# EasyEDA schematic SCH_Full Bridge Rectifier V1_2023-05-05.json
TITLE: Sheet_1; REV: 1.0; Date: 2023-03-08; Sheet: 1/1; Drawn By: richwasnothere; Company: Your Company
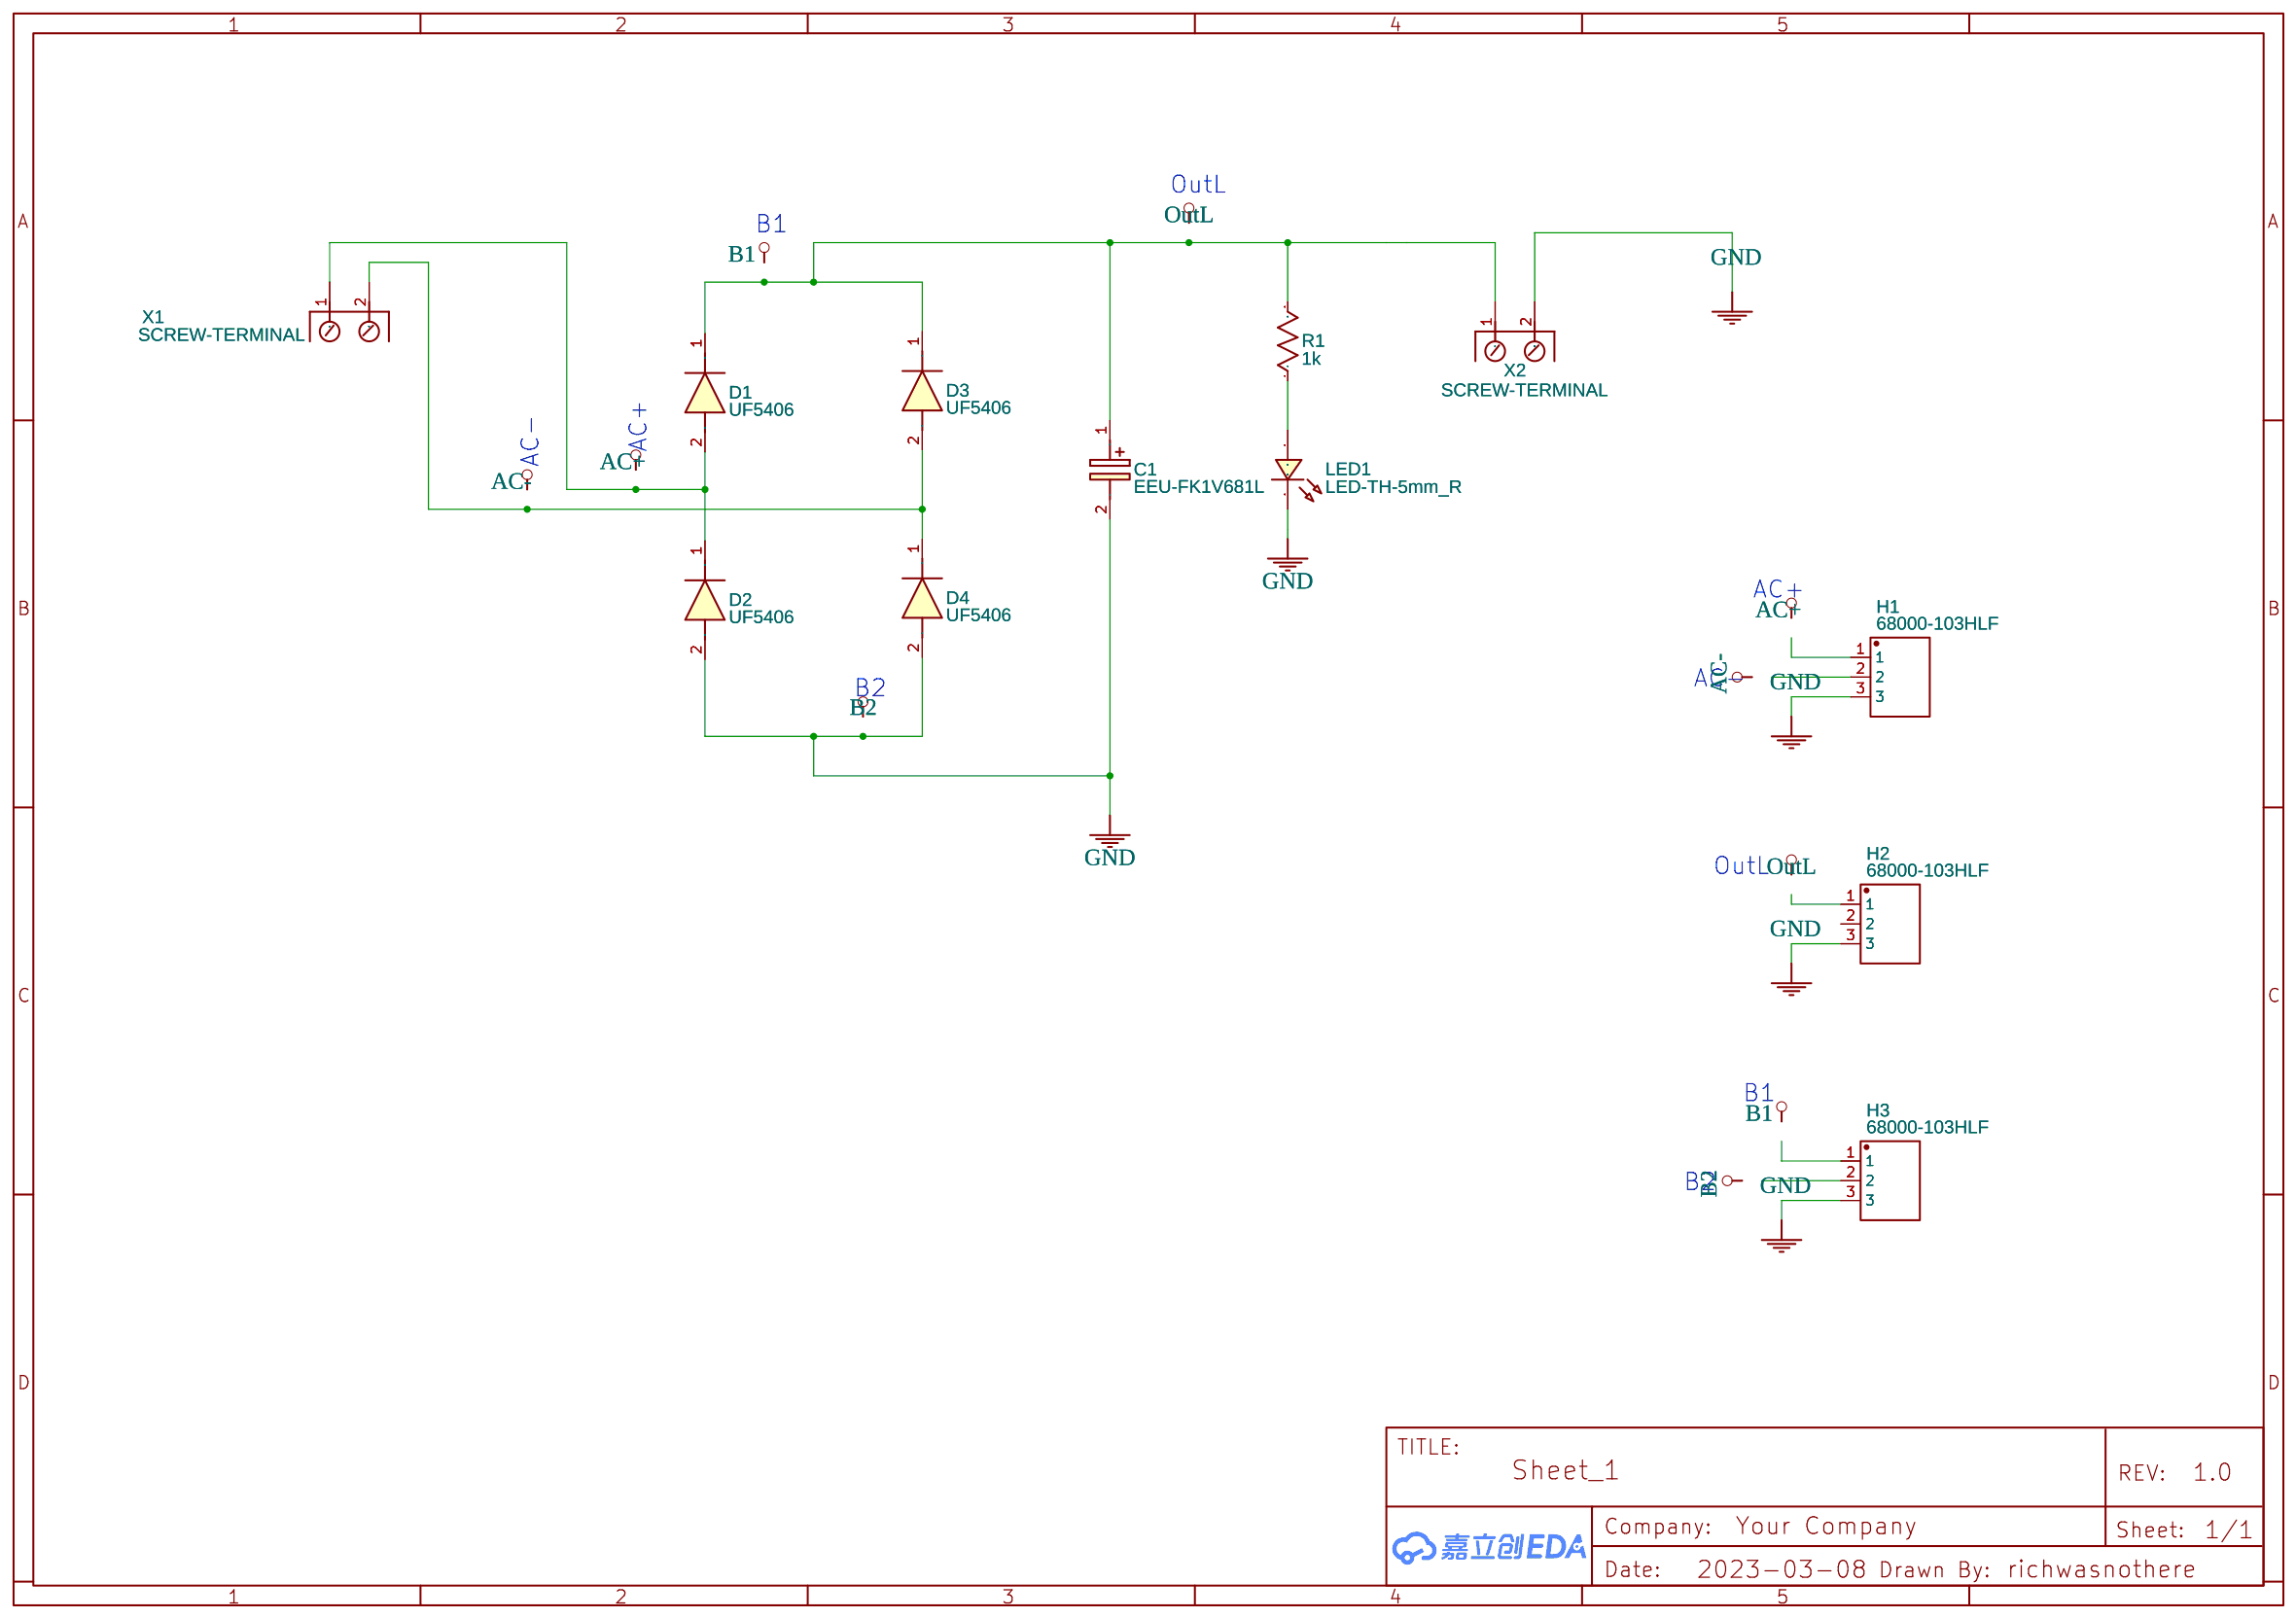
[diagram p0: schematic sheet]

## Parts
C1  EEU-FK1V681L  [CAPPRD500W65D1000H2700]
D1  UF5406  [DIOAD2510W125L750D440]
D2  UF5406  [DIOAD2510W125L750D440]
D3  UF5406  [DIOAD2510W125L750D440]
D4  UF5406  [DIOAD2510W125L750D440]
H1  68000-103HLF  [HDR-TH_3P-P2.54-V-M-1]
H2  68000-103HLF  [HDR-TH_3P-P2.54-V-M-1]
H3  68000-103HLF  [HDR-TH_3P-P2.54-V-M-1]
LED1  LED-TH-5mm_R  [LED-TH_BD5.0_RED]
R1  1k  [R_AXIAL-1.0]
X1  SCREW-TERMINAL  [AKL701_2_13]
X2  SCREW-TERMINAL  [AKL701_2_13]

## Library data of the parts
C1 = EEU-FK1V681L: Contributor: richwasnothere
D1-D4 = UF5406: Contributor: richwasnothere
H1-H3 = 68000-103HLF: Supplier: LCSC; Supplier Part: C168677; Manufacturer: Amphenol; Contributor: LCSC; JLCPCB Part Class: Extended Part
LED1 = LED-TH-5mm_R: Manufacturer: EVERLIGHT(台湾亿光); Manufacturer Part: 333-2SURD/S530-A3; Supplier Part: C87271; Supplier: LCSC; Contributor: LCEDA_Lib
R1 = R_AXIAL-1.0_US: Contributor: LCEDA_Lib
X1 X2 = -: catid: 20; sourceId: PU6sECcLl; Manufacturer Part: ?

## Nets
AC+: D1.2(A) D2.1(K) H1.1 X1.1
AC-: D3.2(A) D4.1(K) H1.2 X1.2
B1: C1.1(+) D1.1(K) D3.1(K) H2.1 H3.1 R1.2 X2.1
B2: C1.2(-) D2.2(A) D4.2(A) H1.3 H2.3 H3.2 H3.3 LED1.2 X2.2
Net-(LED1-1): LED1.1 R1.1

Not connected (* = marked no-connect by the designer): H2 2

## Notes on the sheet
- OutL
- B1
- AC-
- AC+
- AC+
- B2
- AC-
- OutL
- B1
- B2
